# Altium schematic sheet MCU.SchDoc
size A4; SheetNumber: 3; SheetTotal: 8
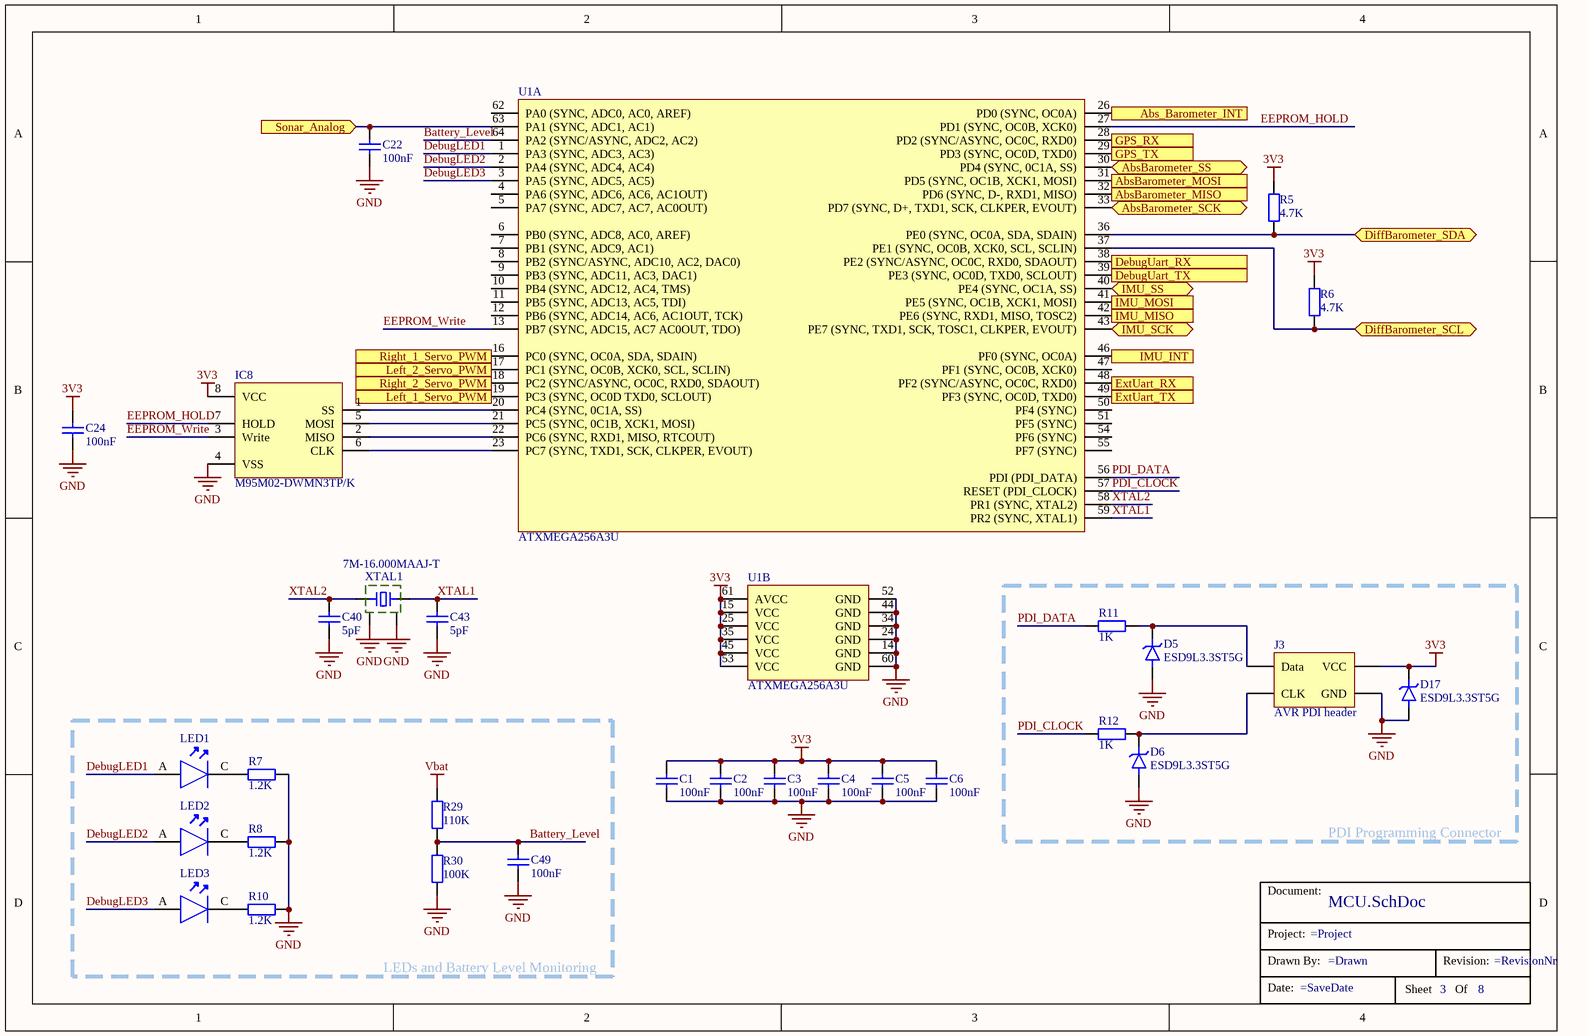
[diagram p0: MCU.SchDoc]

## Parts
*  TitleBox  (value not drawn)
C1  Capacitance: 100nF  [C0603 N]
C2  Capacitance: 100nF  [C0603 N]
C3  Capacitance: 100nF  [C0603 N]
C4  Capacitance: 100nF  [C0603 N]
C5  Capacitance: 100nF  [C0603 N]
C6  Capacitance: 100nF  [C0603 N]
C22  Capacitance: 100nF  [C0603 N]
C24  Capacitance: 100nF  [C0603 N]
C40  Capacitance: 5pF  [C0603 N]
C43  Capacitance: 5pF  [C0603 N]
C49  Capacitance: 100nF  [C0603 N]
D5  ESD9L3.3ST5G  [SOD923F, NOMINAL]
D6  ESD9L3.3ST5G  [SOD923F, NOMINAL]
D17  ESD9L3.3ST5G  [SOD923F, NOMINAL]
IC8  M95M02-DWMN3TP/K  [SOIC8, JEDEC MS-012-AA, Nominal]
J3  AVR PDI header  [Male 2x3 vertical]
LED1  DebugLED1  [0603 NOMINAL]  (value not drawn)
LED2  DebugLED2  [0603 NOMINAL]  (value not drawn)
LED3  DebugLED3  [0603 NOMINAL]  (value not drawn)
R5  4.7K  [R0603]
R6  4.7K  [R0603]
R7  1.2K  [R0603]
R8  1.2K  [R0603]
R10  1.2K  [R0603]
R11  1K  [R0603]
R12  1K  [R0603]
R29  110K  [R0603]
R30  100K  [R0603]
U1  ATXMEGA256A3U  [TQFP-64, NOMINAL]  (parts A,B of 2)
XTAL1  7M-16.000MAAJ-T  [7M 3.2x2.5mm]

## Blocks framed on the sheet
PDI Programming Connector: D5 D6 D17 J3 R11 R12
LEDs and Battery Level Monitoring: C49 LED1-LED3 R7 R8 R10 R29 R30

## Ports
Abs_Barometer_INT (in), AbsBarometer_MISO (in), AbsBarometer_MOSI (out), AbsBarometer_SCK (bidir), AbsBarometer_SS (bidir), DebugUart_RX (in), DebugUart_TX (out), DiffBarometer_SCL (bidir), DiffBarometer_SDA (bidir), ExtUart_RX (in), ExtUart_TX (out), GPS_RX (in), GPS_TX (out), IMU_INT (in), IMU_MISO (in), IMU_MOSI (out), IMU_SCK (bidir), IMU_SS (bidir), Left_1_Servo_PWM (out), Left_2_Servo_PWM (out), Right_1_Servo_PWM (out), Right_2_Servo_PWM (out), Sonar_Analog (in)

## Nets
3V3: C1.2 C2.2 C3.2 C4.2 C5.2 C6.2 C24.2 D17.C IC8.8(VCC) J3.2(VCC) R5.2 R6.2 U1.15(VCC) U1.25(VCC) U1.35(VCC) U1.45(VCC) U1.53(VCC) U1.61(AVCC)
GND: C1.1 C2.1 C3.1 C4.1 C5.1 C6.1 C22.1 C24.1 C40.1 C43.1 C49.1 D5.A D6.A D17.A IC8.4(VSS) J3.6(GND) R7.1 R8.1 R10.1 R30.2 U1.14(GND) U1.24(GND) U1.34(GND) U1.44(GND) U1.52(GND) U1.60(GND) XTAL1.2(gnd) XTAL1.4(gnd1)
Vbat: R29.1
Abs_Barometer_INT: U1.26(PD0_(SYNC,_OC0A)) ; port Abs_Barometer_INT
AbsBarometer_MISO: U1.32(PD6_(SYNC,_D-,_RXD1,_MISO)) ; port AbsBarometer_MISO
AbsBarometer_MOSI: U1.31(PD5_(SYNC,_OC1B,_XCK1,_MOSI)) ; port AbsBarometer_MOSI
AbsBarometer_SCK: U1.33(PD7_(SYNC,_D+,_TXD1,_SCK,_CLKPER,_EVOUT)) ; port AbsBarometer_SCK
AbsBarometer_SS: U1.30(PD4_(SYNC,_0C1A,_SS)) ; port AbsBarometer_SS
Battery_Level: C49.2 R29.2 R30.1 U1.64(PA2_(SYNC/ASYNC,_ADC2,_AC2))
DebugLED1: LED1.A U1.1(PA3_(SYNC,_ADC3,_AC3))
DebugLED2: LED2.A U1.2(PA4_(SYNC,_ADC4,_AC4))
DebugLED3: LED3.A U1.3(PA5_(SYNC,_ADC5,_AC5))
DebugUart_RX: U1.38(PE2_(SYNC/ASYNC,_OC0C,_RXD0,_SDAOUT)) ; port DebugUart_RX
DebugUart_TX: U1.39(PE3_(SYNC,_OC0D,_TXD0,_SCLOUT)) ; port DebugUart_TX
DiffBarometer_SCL: R6.1 U1.37(PE1_(SYNC,_OC0B,_XCK0,_SCL,_SCLIN)) ; port DiffBarometer_SCL
DiffBarometer_SDA: R5.1 U1.36(PE0_(SYNC,_OC0A,_SDA,_SDAIN)) ; port DiffBarometer_SDA
EEPROM_HOLD: IC8.7(HOLD) U1.27(PD1_(SYNC,_OC0B,_XCK0))
EEPROM_Write: IC8.3(Write) U1.13(PB7_(SYNC,_ADC15,_AC7_AC0OUT,_TDO))
ExtUart_RX: U1.48(PF2_(SYNC/ASYNC,_OC0C,_RXD0)) ; port ExtUart_RX
ExtUart_TX: U1.49(PF3_(SYNC,_OC0D,_TXD0)) ; port ExtUart_TX
GPS_RX: U1.28(PD2_(SYNC/ASYNC,_OC0C,_RXD0)) ; port GPS_RX
GPS_TX: U1.29(PD3_(SYNC,_OC0D,_TXD0)) ; port GPS_TX
IMU_INT: U1.46(PF0_(SYNC,_OC0A)) ; port IMU_INT
IMU_MISO: U1.42(PE6_(SYNC,_RXD1,_MISO,_TOSC2)) ; port IMU_MISO
IMU_MOSI: U1.41(PE5_(SYNC,_OC1B,_XCK1,_MOSI)) ; port IMU_MOSI
IMU_SCK: U1.43(PE7_(SYNC,_TXD1,_SCK,_TOSC1,_CLKPER,_EVOUT)) ; port IMU_SCK
IMU_SS: U1.40(PE4_(SYNC,_OC1A,_SS)) ; port IMU_SS
Left_1_Servo_PWM: U1.19(PC3_(SYNC,_OC0D_TXD0,_SCLOUT)) ; port Left_1_Servo_PWM
Left_2_Servo_PWM: U1.17(PC1_(SYNC,_OC0B,_XCK0,_SCL,_SCLIN)) ; port Left_2_Servo_PWM
PDI_CLOCK: R12.2 U1.57(RESET_(PDI_CLOCK))
PDI_DATA: R11.2 U1.56(PDI_(PDI_DATA))
Right_1_Servo_PWM: U1.16(PC0_(SYNC,_OC0A,_SDA,_SDAIN)) ; port Right_1_Servo_PWM
Right_2_Servo_PWM: U1.18(PC2_(SYNC/ASYNC,_OC0C,_RXD0,_SDAOUT)) ; port Right_2_Servo_PWM
Sonar_Analog: C22.2 U1.63(PA1_(SYNC,_ADC1,_AC1)) ; port Sonar_Analog
XTAL1: C43.2 U1.59(PR2_(SYNC,_XTAL1)) XTAL1.3(X2)
XTAL2: C40.2 U1.58(PR1_(SYNC,_XTAL2)) XTAL1.1(X1)
NetD5_C: D5.C J3.1(Data) R11.1
NetD6_C: D6.C J3.5(CLK) R12.1
NetIC8_1: IC8.1(SS) U1.20(PC4_(SYNC,_0C1A,_SS))
NetIC8_2: IC8.2(MISO) U1.22(PC6_(SYNC,_RXD1,_MISO,_RTCOUT))
NetIC8_5: IC8.5(MOSI) U1.21(PC5_(SYNC,_0C1B,_XCK1,_MOSI))
NetIC8_6: IC8.6(CLK) U1.23(PC7_(SYNC,_TXD1,_SCK,_CLKPER,_EVOUT))
NetLED1_C: LED1.C R7.2
NetLED2_C: LED2.C R8.2
NetLED3_C: LED3.C R10.2

Not connected (* = marked no-connect by the designer): U1 4(PA6_(SYNC,_ADC6,_AC6,_AC1OUT)) 5(PA7_(SYNC,_ADC7,_AC7,_AC0OUT)) 6(PB0_(SYNC,_ADC8,_AC0,_AREF)) 7(PB1_(SYNC,_ADC9,_AC1)) 8(PB2_(SYNC/ASYNC,_ADC10,_AC2,_DAC0)) 9(PB3_(SYNC,_ADC11,_AC3,_DAC1)) 10(PB4_(SYNC,_ADC12,_AC4,_TMS)) 11(PB5_(SYNC,_ADC13,_AC5,_TDI)) 12(PB6_(SYNC,_ADC14,_AC6,_AC1OUT,_TCK)) 47(PF1_(SYNC,_OC0B,_XCK0)) 50(PF4_(SYNC)) 51(PF5_(SYNC)) 54(PF6_(SYNC)) 55(PF7_(SYNC)) 62(PA0_(SYNC,_ADC0,_AC0,_AREF))

## Notes on the sheet
- (in symbol TitleBox) Document:; Project:; Drawn By:; Revision:; Date:; Sheet; Of

## Library data of the parts
C1-C6 C22 C24 C40 C43 C49 = Capacitor: Ceramic capacitor; Type: MLCC; Voltage rating: *V; Characteristic: *; Manufacturer: *; Note: C0603 N
D5 D6 D17 = ESD9L3.3ST5G: TVS DIODE, Unidir, 3.3V/9V, 150mW, SOD-923, ESD9L3.3ST5G, ON SEMICONDUCTOR; Clamping Voltage: 9V; Reverse Standoff Voltage: 3.3V; Breakdown Voltage: 4.8V; Peak Pulse Current: 1A; Leakage Current: 1uA; Supplier 1: Farnell; Manufacturer: ON Semiconductor; Manufacturer Part Number: ESD9L3.3ST5G; Case/Package: SOD-923-2; Operating Temperature Range: -55 .. 125°C; Peak Pulse Power: 150mW; ComponentLink1URL: https://www.verical.com/server-webapp/html/getDatasheet?partID=148186&src-supplier=Verical; ComponentLink1Description: Datasheet; Supplier Part Number 1: 2533269
IC8 = M95M02-DWMN3TP/K: EEPROM, 2.5...5Vin, 2Mbit, 256Kx8Bit, SPI, 5...10MHz; ComponentLink1Description: Datasheet; ComponentLink1URL: http://www.farnell.com/datasheets/2374181.pdf?_ga=2.101041480.87678497.1585049483-1429076973.1585049483
J3 = AVR PDI header 2x3 male: Male header 2x3, PDI
LED1-LED3 = Generic LED: SMD mono-color Chip LED; Color: Green
R5-R8 R10-R12 R29 R30 = Resistor: Precision: *%; Voltage rating: *V; Temp coefficient: *ppm; Power rating: *mW; Manufacturer: *; Note: R0603
  R5 R6: Resistance: 4.7K
  R7 R8 R10: Resistance: 1.2K
  R11 R12: Resistance: 1K
  R29: Resistance: 110K
  R30: Resistance: 100K
U1 = ATXMEGA256A3U: MCU, 8-bit, 256KB flash, 50 I/Os, ATXMEGA2563U, 64-TQFP, Microchip; Supplier 1: Farnell; ComponentLink1Description: Datasheet; ComponentLink1URL: http://ww1.microchip.com/downloads/en/devicedoc/atmel-8386-8-and-16-bit-avr-microcontroller-atxmega64a3u-128a3u-192a3u-256a3u_datasheet.pdf; Supplier Part Number 1: 2066307
XTAL1 = 7M-16.000MAAJ-T: Manufacturer: TXC; Frequency: 16MHz; Frequency Tolerance: 30ppm; Load Capacitance: 18pF; ESR (Equivalent Series Resistance): 100R; Supplier 1: Farnell; Supplier Part Number 1: 1842060; Manufacturer Part Number: 7M-16.000MAAJ-T; Pricing 1: 1=1.09, 50=0.726, 100=0.642, 250=0.625, 500=0.608, 1000=0.516, 5000=0.506 (EUR); Case/Package: SMD/SMT; Operating Temperature Range: -10°C .. 70°C; Tolerance: 30ppm; Frequency Stability: 30ppm; Length: 3.2mm; Height: 0.031inch; Dimensions: 3.2mm*2.5mm; ComponentLink1URL: https://datasheet.ciiva.com/1356/number-crystal-basic-1356577.pdf; ComponentLink1Description: Datasheet; ComponentLink3URL: https://datasheet.ciiva.com/855/7m-855384.pdf; ComponentLink3Description: Datasheet; Supplier 2: Mouser; Supplier Part Number 2: 717-7M-16.000MAAJ-T